# Altium project horus_psu.PrjPCB
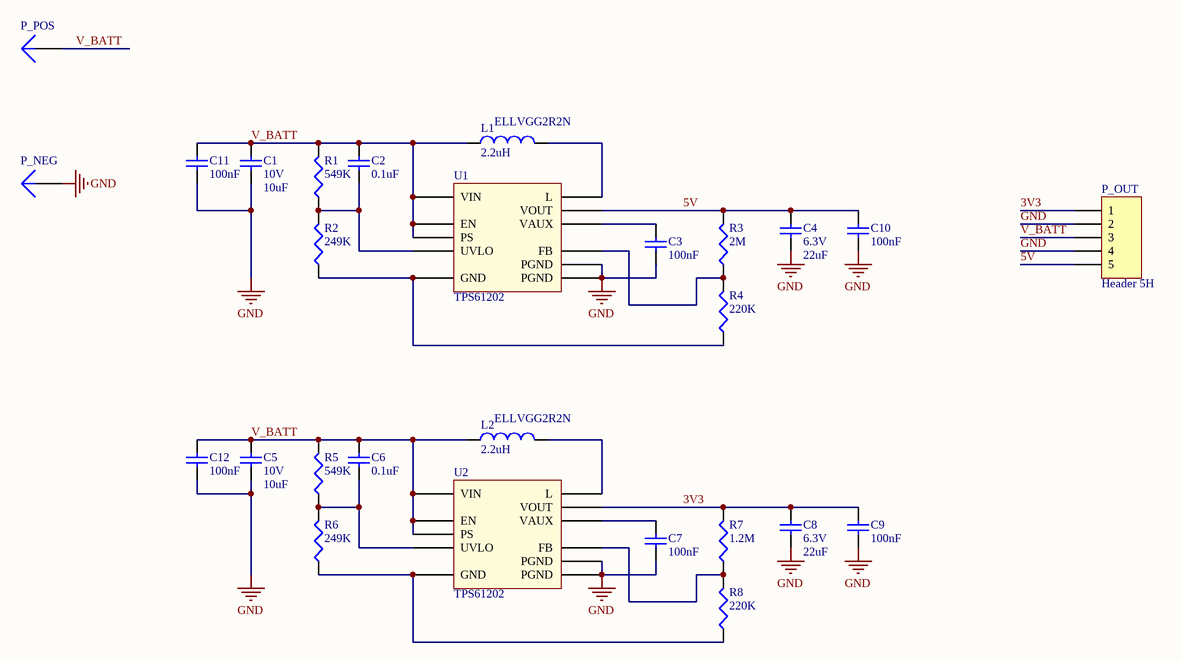
[diagram p0: horus_psu.SchDoc]
1 sheet, 27 parts. Net scope: global (net labels, ports and power ports of the same name join across sheets).
Board file: horus_psu.PcbDoc

## Sheet horus_psu.SchDoc
size A4

### Parts
C1  10V  value 10uF  [C1206]
C2  value 0.1uF  [1608[0603]]  (hidden comment: Cap Semi)
C3  value 100nF  [1608[0603]]  (hidden comment: Cap Semi)
C4  6.3V  value 22uF  [6-0805_N]
C5  10V  value 10uF  [C1206]
C6  value 0.1uF  [1608[0603]]  (hidden comment: Cap Semi)
C7  value 100nF  [1608[0603]]  (hidden comment: Cap Semi)
C8  6.3V  value 22uF  [6-0805_N]
C9  value 100nF  [1608[0603]]  (hidden comment: Cap Semi)
C10  value 100nF  [1608[0603]]  (hidden comment: Cap Semi)
C11  value 100nF  [1608[0603]]  (hidden comment: Cap Semi)
C12  value 100nF  [1608[0603]]  (hidden comment: Cap Semi)
L1  ELLVGG2R2N  value 2.2uH  [ELLVGG]
L2  ELLVGG2R2N  value 2.2uH  [ELLVGG]
P_NEG  Plug  [PIN1]  (value not drawn)
P_OUT  Header 5H  [HDR1X5H]
P_POS  Plug  [PIN1]  (value not drawn)
R1  value 549K  [J1-0603]  (hidden comment: Res3)
R2  value 249K  [J1-0603]  (hidden comment: Res3)
R3  value 2M  [1608[0603]]  (hidden comment: Res3)
R4  value 220K  [1608[0603]]  (hidden comment: Res3)
R5  value 549K  [J1-0603]  (hidden comment: Res3)
R6  value 249K  [J1-0603]  (hidden comment: Res3)
R7  value 1.2M  [1608[0603]]  (hidden comment: Res3)
R8  value 220K  [1608[0603]]  (hidden comment: Res3)
U1  TPS61202  [TPS61200]
U2  TPS61202  [TPS61200]

### Nets
GND: C1.1 C3.1 C4.1 C5.1 C7.1 C8.1 C9.1 C10.1 C11.1 C12.1 P_NEG.1 P_OUT.2 P_OUT.4 U1.0(PGND) U1.4(PGND) U2.0(PGND) U2.4(PGND)
3V3: C8.2 C9.2 P_OUT.1 R7.2 U2.2(VOUT)
5V: C4.2 C10.2 P_OUT.5 R3.2 U1.2(VOUT)
V_BATT: C1.2 C2.2 C5.2 C6.2 C11.2 C12.2 L1.1 L2.1 P_OUT.3 P_POS.1 R1.2 R5.2 U1.5(VIN) U1.6(EN) U1.8(PS) U2.5(VIN) U2.6(EN) U2.8(PS)
NetC2_1: C2.1 R1.1 R2.2 U1.7(UVLO)
NetC3_2: C3.2 U1.1(VAUX)
NetC6_1: C6.1 R5.1 R6.2 U2.7(UVLO)
NetC7_2: C7.2 U2.1(VAUX)
NetL1_2: L1.2 U1.3(L)
NetL2_2: L2.2 U2.3(L)
NetR2_1: R2.1 R4.1 U1.9(GND)
NetR3_1: R3.1 R4.2 U1.10(FB)
NetR6_1: R6.1 R8.1 U2.9(GND)
NetR7_1: R7.1 R8.2 U2.10(FB)

### Library data of the parts
C1-C12 = Cap Semi: Capacitor (Semiconductor SIM Model); Published: 8-Jun-2000; LatestRevisionDate: 29-May-2009; LatestRevisionNote: IPC-7351 Footprint Added.; PackageReference: C1206; Publisher: Altium Limited; PackageDescription: Chip Capacitor
L1 L2 = Inductor: Code_IEC: 1005; Published: 8-Jun-2000; LatestRevisionDate: 29-May-2009; LatestRevisionNote: IPC-7351 Footprint Added.; PackageReference: 0402-A; Publisher: Altium Limited; PackageDescription: Chip Inductor; Code_JEITA: 0402
P_OUT = Header 5H: Header, 5-Pin, Right Angle; LatestRevisionDate: 17-Jul-2002; LatestRevisionNote: Re-released for DXP Platform.; Publisher: Altium Limited
R1-R8 = Res3: Resistor; Published: 8-Jun-2000; LatestRevisionDate: 29-May-2009; LatestRevisionNote: IPC-7351 Footprint Added.; PackageReference: J1-0603; Publisher: Altium Limited; PackageDescription: Chip Resistor
U1 U2 = TPS61200
P_NEG P_POS = Plug: LatestRevisionDate: 17-Jul-2002; LatestRevisionNote: Re-released for DXP Platform.; Publisher: Altium Limited